# Altium schematic sheet Zynq processing system (PS).SchDoc
size A2; SheetNumber: 5; SheetTotal: 11
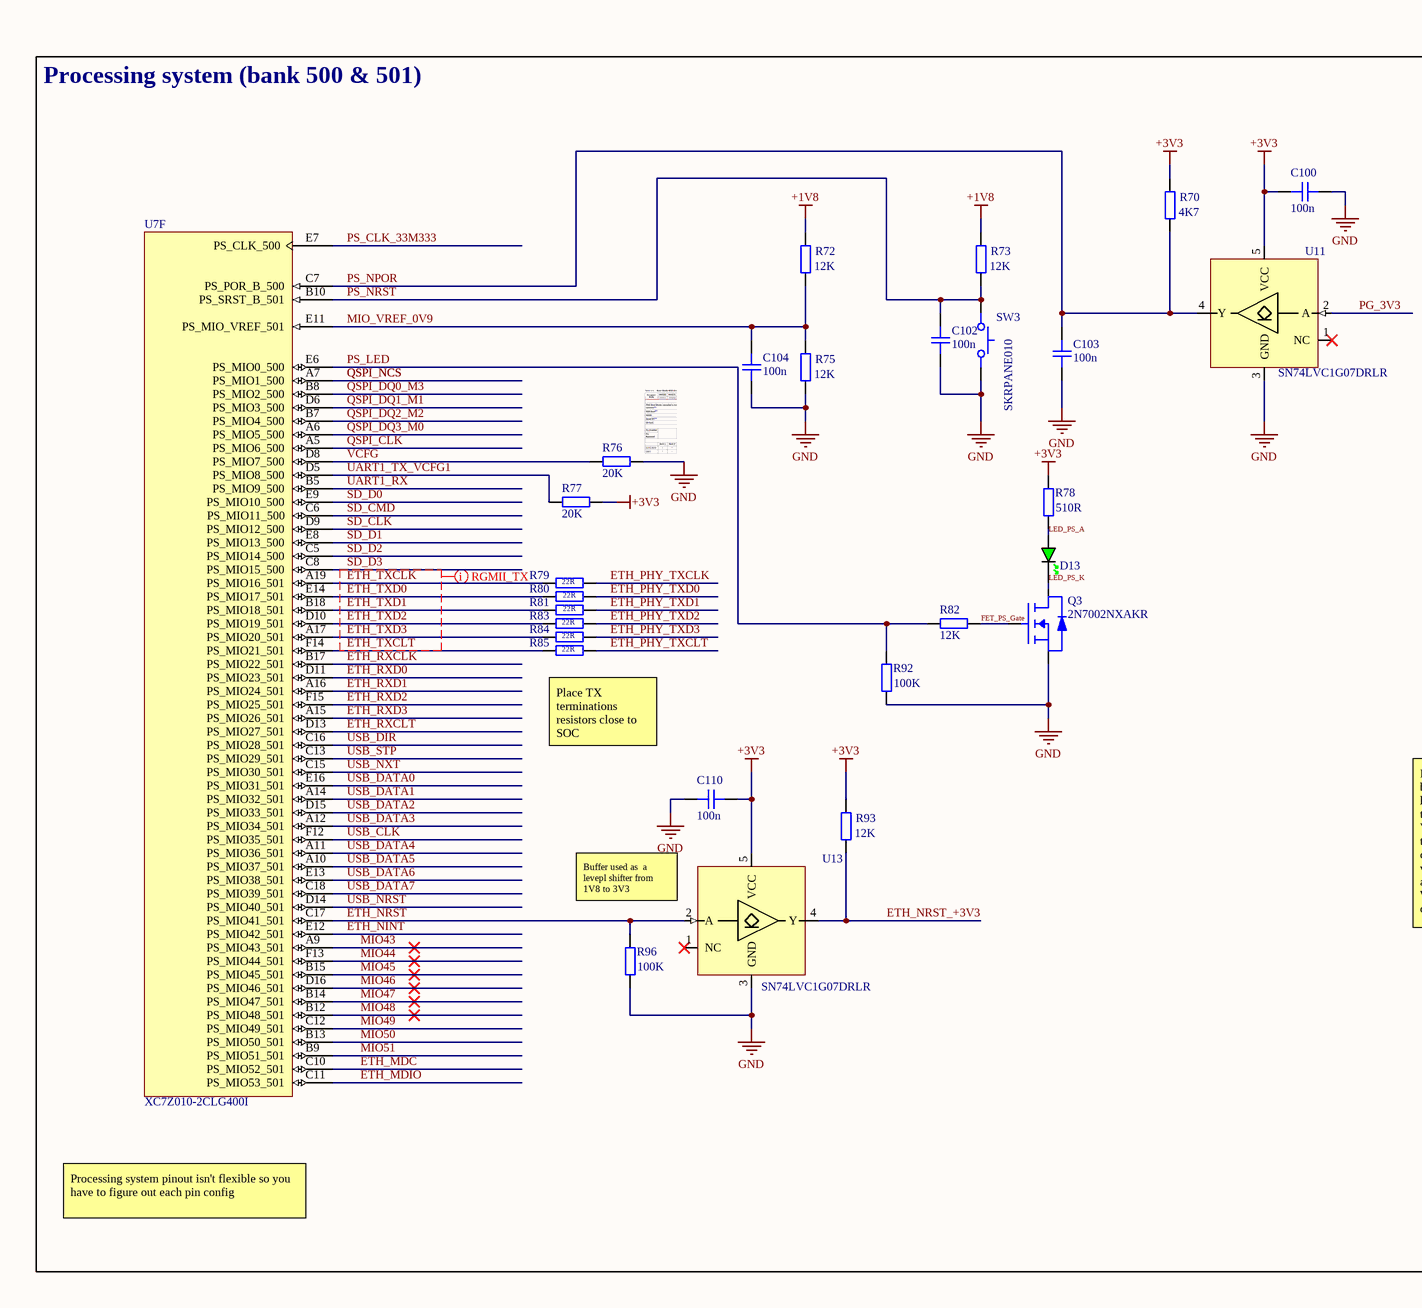
[diagram p0: Zynq processing system (PS).SchDoc, left]
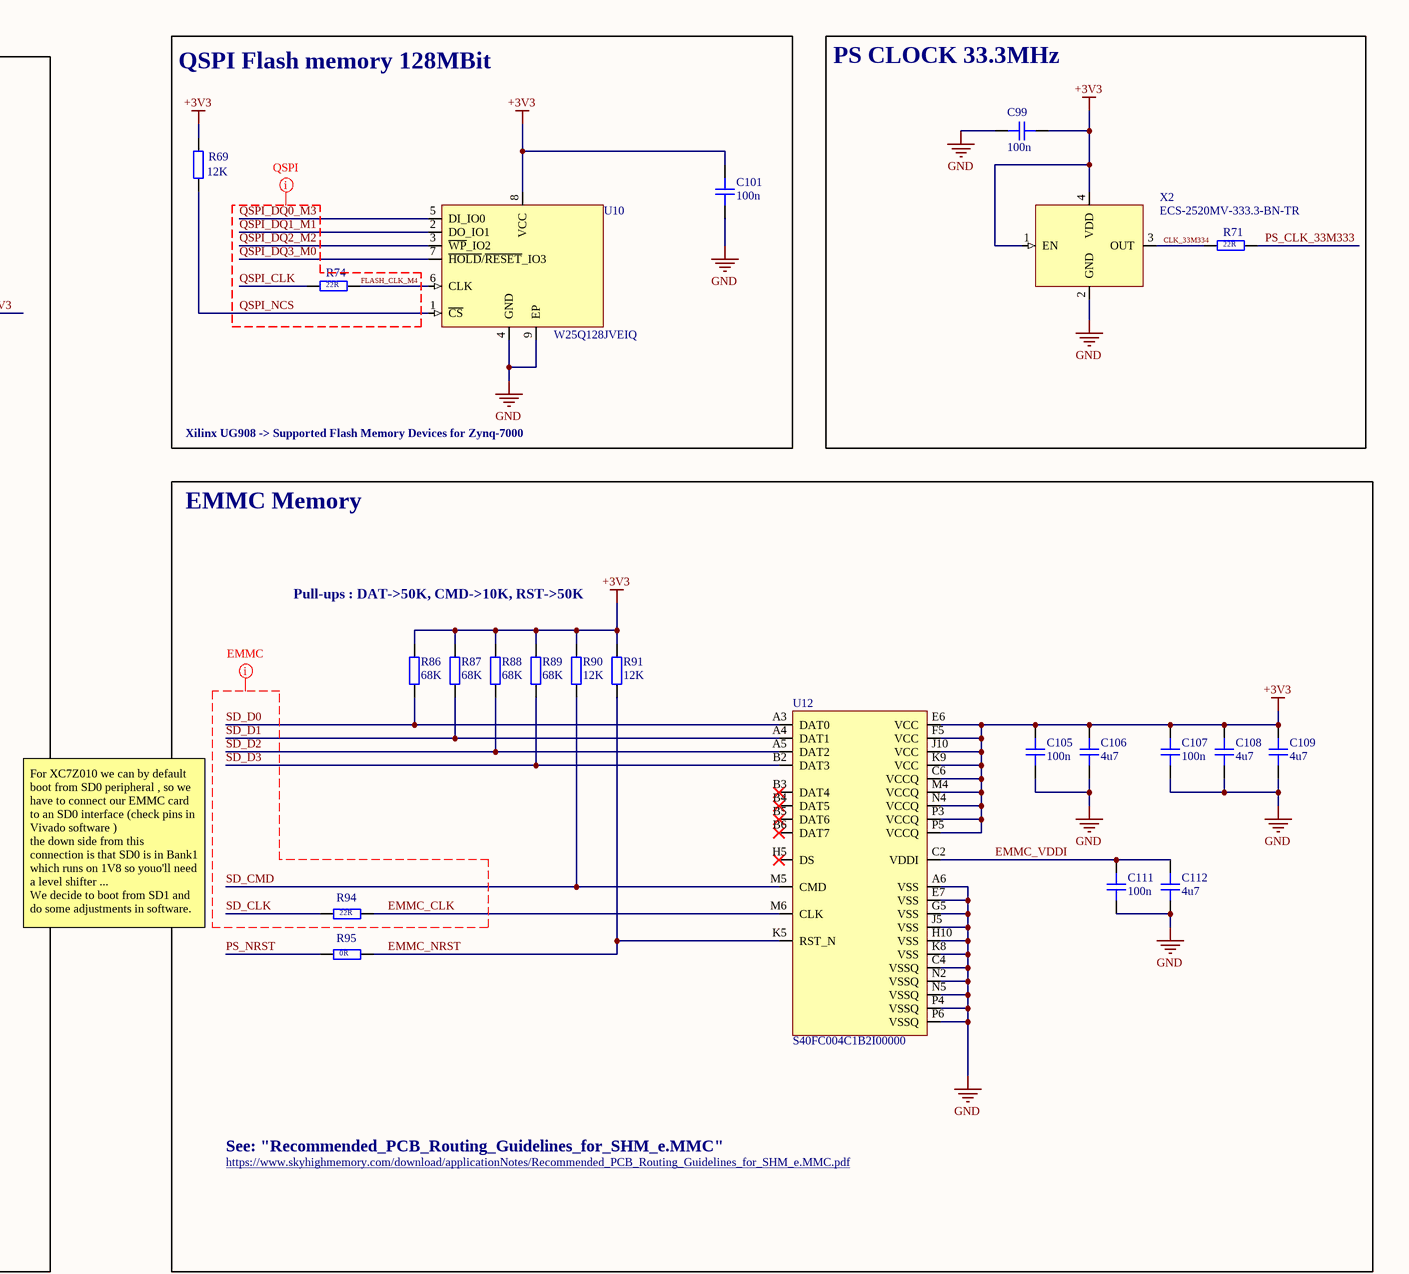
[diagram p1: Zynq processing system (PS).SchDoc, right]

## Parts
C99  100n  [CAP_0402]
C100  100n  [CAP_0402]
C101  100n  [CAP_0402]
C102  100n  [CAP_0402]
C103  100n  [CAP_0402]
C104  100n  [CAP_0402]
C105  100n  [CAP_0402]
C106  4u7  [CAP_0402]
C107  100n  [CAP_0402]
C108  4u7  [CAP_0402]
C109  4u7  [CAP_0402]
C110  100n  [CAP_0402]
C111  100n  [CAP_0402]
C112  4u7  [CAP_0402]
D13  GREEN  [LED_0402_GREEN]  (value not drawn)
Q3  2N7002NXAKR  [SSM3J338R,LF-SOT23-F]
R69  value 12K  [RES_0402]  (hidden comment: R0402)
R70  value 4K7  [RES_0402]  (hidden comment: R0402)
R71  value 22R  [RES_0402]  (hidden comment: R0402)
R72  value 12K  [RES_0402]  (hidden comment: R0402)
R73  value 12K  [RES_0402]  (hidden comment: R0402)
R74  value 22R  [RES_0402]  (hidden comment: R0402)
R75  value 12K  [RES_0402]  (hidden comment: R0402)
R76  value 20K  [RES_0402]  (hidden comment: R0402)
R77  value 20K  [RES_0402]  (hidden comment: R0402)
R78  value 510R  [RES_0402]  (hidden comment: R0402)
R79  value 22R  [RES_0402]  (hidden comment: R0402)
R80  value 22R  [RES_0402]  (hidden comment: R0402)
R81  value 22R  [RES_0402]  (hidden comment: R0402)
R82  value 12K  [RES_0402]  (hidden comment: R0402)
R83  value 22R  [RES_0402]  (hidden comment: R0402)
R84  value 22R  [RES_0402]  (hidden comment: R0402)
R85  value 22R  [RES_0402]  (hidden comment: R0402)
R86  value 68K  [RES_0402]  (hidden comment: R0402)
R87  value 68K  [RES_0402]  (hidden comment: R0402)
R88  value 68K  [RES_0402]  (hidden comment: R0402)
R89  value 68K  [RES_0402]  (hidden comment: R0402)
R90  value 12K  [RES_0402]  (hidden comment: R0402)
R91  value 12K  [RES_0402]  (hidden comment: R0402)
R92  value 100K  [RES_0402]  (hidden comment: R0402)
R93  value 12K  [RES_0402]  (hidden comment: R0402)
R94  value 22R  [RES_0402]  (hidden comment: R0402)
R95  value 0R  [RES_0402]  (hidden comment: R0402)
R96  value 100K  [RES_0402]  (hidden comment: R0402)
SW3  SKRPANE010  [SKRPANE010]
U7  XC7Z010-2CLG400I  [BGA400C80P20X20_1700X1700X160N]  (part F of 9)
U10  W25Q128JVEIQ  [WSON-8-8X6]
U11  SN74LVC1G07DRLR  [SOT-5]
U12  S40FC004C1B2I00000  [VFBGA153-9.0x7.5x0.8]
U13  SN74LVC1G07DRLR  [SOT-5]
X2  ECS-2520MV-333.3-BN-TR  [XTAL_2520]

## Blocks framed on the sheet
Processing system (bank 500 & 501): C100 C102-C104 C110 D13 Q3 R70 R72 R73 R75-R85 R92 R93 R96 SW3 U7 U11 U13
QSPI Flash memory 128MBit: C101 R69 R74 U10
PS CLOCK 33.3MHz: C99 R71 X2
EMMC Memory: C105-C109 C111 C112 R86-R91 R94 R95 U12

## Nets
+1V8: R72.2 R73.2
+3V3: C99.1 C100.2 C101.1 C105.1 C106.1 C107.1 C108.1 C109.1 C110.2 R69.2 R70.2 R77.1 R78.1 R86.1 R87.1 R88.1 R89.1 R90.1 R91.1 R93.2 U10.8(VCC) U11.5(VCC) U12.C6(VCCQ) U12.E6(VCC) U12.F5(VCC) U12.J10(VCC) U12.K9(VCC) U12.M4(VCCQ) U12.N4(VCCQ) U12.P3(VCCQ) U12.P5(VCCQ) U13.5(VCC) X2.1(EN) X2.4(VDD)
GND: C99.2 C100.1 C101.2 C102.2 C103.2 C104.2 C105.2 C106.2 C107.2 C108.2 C109.2 C110.1 C111.2 C112.2 Q3.S R75.1 R76.1 R92.2 R96.2 SW3.12 U10.4(GND) U10.9(EP) U11.3(GND) U12.A6(VSS) U12.C4(VSSQ) U12.E7(VSS) U12.G5(VSS) U12.H10(VSS) U12.J5(VSS) U12.K8(VSS) U12.N2(VSSQ) U12.N5(VSSQ) U12.P4(VSSQ) U12.P6(VSSQ) U13.3(GND) X2.2(GND)
CLK_33M334: R71.2 X2.3(OUT)
EMMC_CLK: R94.1 U12.M6(CLK)
EMMC_NRST: R91.2 R95.1 U12.K5(RST_N)
EMMC_VDDI: C111.1 C112.1 U12.C2(VDDI)
ETH_MDC: U7.C10(PS_MIO52_501)
ETH_MDIO: U7.C11(PS_MIO53_501)
ETH_NINT: U7.E12(PS_MIO42_501)
ETH_NRST: R96.1 U7.C17(PS_MIO41_501) U13.2(A)
ETH_NRST_+3V3: R93.1 U13.4(Y)
ETH_PHY_TXCLK: R79.1
ETH_PHY_TXCLT: R85.1
ETH_PHY_TXD0: R80.1
ETH_PHY_TXD1: R81.1
ETH_PHY_TXD2: R83.1
ETH_PHY_TXD3: R84.1
ETH_RXCLK: U7.B17(PS_MIO22_501)
ETH_RXCLT: U7.D13(PS_MIO27_501)
ETH_RXD0: U7.D11(PS_MIO23_501)
ETH_RXD1: U7.A16(PS_MIO24_501)
ETH_RXD2: U7.F15(PS_MIO25_501)
ETH_RXD3: U7.A15(PS_MIO26_501)
ETH_TXCLK: R79.2 U7.A19(PS_MIO16_501)
ETH_TXCLT: R85.2 U7.F14(PS_MIO21_501)
ETH_TXD0: R80.2 U7.E14(PS_MIO17_501)
ETH_TXD1: R81.2 U7.B18(PS_MIO18_501)
ETH_TXD2: R83.2 U7.D10(PS_MIO19_501)
ETH_TXD3: R84.2 U7.A17(PS_MIO20_501)
FET_PS_Gate: Q3.G R82.1
FLASH_CLK_M4: R74.1 U10.6(CLK)
LED_PS_A: D13.A R78.2
LED_PS_K: D13.K Q3.D
MIO43: U7.A9(PS_MIO43_501)
MIO44: U7.F13(PS_MIO44_501)
MIO45: U7.B15(PS_MIO45_501)
MIO46: U7.D16(PS_MIO46_501)
MIO47: U7.B14(PS_MIO47_501)
MIO48: U7.B12(PS_MIO48_501)
MIO49: U7.C12(PS_MIO49_501)
MIO50: U7.B13(PS_MIO50_501)
MIO51: U7.B9(PS_MIO51_501)
MIO_VREF_0V9: C104.1 R72.1 R75.2 U7.E11(PS_MIO_VREF_501)
PG_3V3: U11.2(A)
PS_CLK_33M333: R71.1 U7.E7(PS_CLK_500)
PS_LED: R82.2 R92.1 U7.E6(PS_MIO0_500)
PS_NPOR: C103.1 R70.1 U7.C7(PS_POR_B_500) U11.4(Y)
PS_NRST: C102.1 R73.1 R95.2 SW3.34 U7.B10(PS_SRST_B_501)
QSPI_CLK: R74.2 U7.A5(PS_MIO6_500)
QSPI_DQ0_M3: U7.B8(PS_MIO2_500) U10.5(DI_IO0)
QSPI_DQ1_M1: U7.D6(PS_MIO3_500) U10.2(DO_IO1)
QSPI_DQ2_M2: U7.B7(PS_MIO4_500) U10.3(~{WP}_IO2)
QSPI_DQ3_M0: U7.A6(PS_MIO5_500) U10.7(~{HOLD}/~{RESET}_IO3)
QSPI_NCS: R69.1 U7.A7(PS_MIO1_500) U10.1(~{CS})
SD_CLK: R94.2 U7.D9(PS_MIO12_500)
SD_CMD: R90.2 U7.C6(PS_MIO11_500) U12.M5(CMD)
SD_D0: R86.2 U7.E9(PS_MIO10_500) U12.A3(DAT0)
SD_D1: R87.2 U7.E8(PS_MIO13_500) U12.A4(DAT1)
SD_D2: R88.2 U7.C5(PS_MIO14_500) U12.A5(DAT2)
SD_D3: R89.2 U7.C8(PS_MIO15_500) U12.B2(DAT3)
UART1_RX: U7.B5(PS_MIO9_500)
UART1_TX_VCFG1: R77.2 U7.D5(PS_MIO8_500)
USB_CLK: U7.F12(PS_MIO35_501)
USB_DATA0: U7.E16(PS_MIO31_501)
USB_DATA1: U7.A14(PS_MIO32_501)
USB_DATA2: U7.D15(PS_MIO33_501)
USB_DATA3: U7.A12(PS_MIO34_501)
USB_DATA4: U7.A11(PS_MIO36_501)
USB_DATA5: U7.A10(PS_MIO37_501)
USB_DATA6: U7.E13(PS_MIO38_501)
USB_DATA7: U7.C18(PS_MIO39_501)
USB_DIR: U7.C16(PS_MIO28_501)
USB_NRST: U7.D14(PS_MIO40_501)
USB_NXT: U7.C15(PS_MIO30_501)
USB_STP: U7.C13(PS_MIO29_501)
VCFG: R76.2 U7.D8(PS_MIO7_500)

Not connected (* = marked no-connect by the designer): U11 1(NC)*; U12 B3(DAT4)* B4(DAT5)* B5(DAT6)* B6(DAT7)* H5(DS)*; U13 1(NC)*

## Layout directives
net class QSPI: FLASH_CLK_M4, QSPI_CLK, QSPI_DQ0_M3, QSPI_DQ1_M1, QSPI_DQ2_M2, QSPI_DQ3_M0, QSPI_NCS
net class RGMII_TX; rule Matched Net Lengths [Delay Tolerance = 20ps]: ETH_TXCLK, ETH_TXCLT, ETH_TXD0, ETH_TXD1, ETH_TXD2, ETH_TXD3, SD_D3
net class EMMC; rule Matched Net Lengths [Delay Tolerance = 20ps]; rule Width Constraint [Pref Impedance = 50.00ohms    Min Impedance = 50.00ohms    Max Impedance = 50.00ohms]: EMMC_CLK, SD_CLK, SD_CMD, SD_D0, SD_D1, SD_D2, SD_D3

## Notes on the sheet
- Xilinx UG908 -> Supported Flash Memory Devices for Zynq-7000
- Pull-ups : DAT->50K, CMD->10K, RST->50K
- Place TX terminations resistors close to SOC
- (near U13) Buffer used as  a levepl shifter from 1V8 to 3V3
- For XC7Z010 we can by default boot from SD0 peripheral , so we have to connect our EMMC card to an SD0 interface (check pins in Vivado software )
  the down side from this connection is that SD0 is in Bank1 which runs on 1V8 so youo'll need a level shifter ...
  We decide to boot from SD1 and do some adjustments in software.
- See: "Recommended_PCB_Routing_Guidelines_for_SHM_e.MMC"
- https://www.skyhighmemory.com/download/applicationNotes/Recommended_PCB_Routing_Guidelines_for_SHM_e.MMC.pdf
- Processing system pinout isn't flexible so you have to figure out each pin config

## Library data of the parts
C99-C112 = CAP_0402: Capacitor SMD 0402; Manufacturer: *; Manufacturer Part Number: *; Distributor Link: *; LCSC: *; Rating: *; Dielectric: *
D13 = LED_0402_GREEN: LED 0402 GREEN SMD
Q3 = 2N7002NXAKR: MOSFET N-Channel Vds=60V Id=300mA with ESD Protection; Manufacturer: Nexperia; Manufacturer Part Number: 2N7002NXAKR
R69-R96 = RES_0402: Resistor SMD 0402; Manufacturer: *; Manufacturer Part Number: *; Distributor Link: *; LCSC: *
SW3 = SKRPANE010: Tactile Switch SMD SPST; Manufacturer: Alps Alpine; Manufacturer Part Number: SKRPANE010
U10 = W25Q128JVEIQ: 3V 128M-BIT SERIAL FLASH MEMORY WITH DUAL/QUAD SPI & QPI & DTR WSON-8; Manufacturer: Winbond; Manufacturer Part Number: W25Q128JVEIQ
U11 U13 = SN74LVC1G07DRLR: Single Buffer/Driver With Open-Drain Output; Manufacturer: Texas Instruments; Manufacturer Part Number: SN74LVC1G07DRLR; Distributor Link: https://www.mouser.de/ProductDetail/Texas-Instruments/SN74LVC1G07DRLR?qs=pajgIaoyDUjwau6f5T7MtQ%3D%3D; LCSC: C183013
U12 = S40FC004C1B2I00000: eMMC MLC Memory 4GB 3V3; Manufacturer: SkyHigh Memory; Manufacturer Part Number: S40FC004C1B2I00000
X2 = ECS-2520MV-130-BN-TR: Standard Clock Oscillators XO (Standard),13MHz,Standby (Power Down),CMOS, Multi-Volt,1.6 V 3.6 V,+/-50ppm,-40 C 85 C,6mA,Surface Mount,4-SMD, No Lead,(2.50mm x 2.00mm),(0.80mm); Manufacturer: ECS; Manufacturer Part Number: ECS-2520MV-130-BN-TR